# Altium schematic sheet schematic.SchDoc: Плата фильтра 1,5/2,5mHz
size 420 x 297 mm; PageSetup: Record=PageOptions|CenterHorizontal=True|CenterVertical=True|PrintScale=1.00|XCorrection=1.00|YCorrection=1.00|PrintKind=1|BorderSize=5000000|LeftOffset=0|BottomOffset=0|Orientation=2|PaperLength=1000|PaperWidth=1000|Scale=100|PaperSource=15|PrintQuality=1200|MediaType=1|DitherType=10|PaperKind=A3|PrintScaleMode=1; Weight: -; ScaleFactor: -; Date: 06.05.2025; CheckedBy: Бойков; Author: Соловьев; CompanyName: РРБО-01-24; Address1: Address1; Address2: Address2; Address3: Address3; Address4: Address4; DocumentNumber: МРАГ.43 1122.800 Э3; SheetNumber: 1; SheetTotal: 1; DocumentType: Схема электрическая принципиальная; FirstReferrence: МРАГ.43 1122.800 Э3
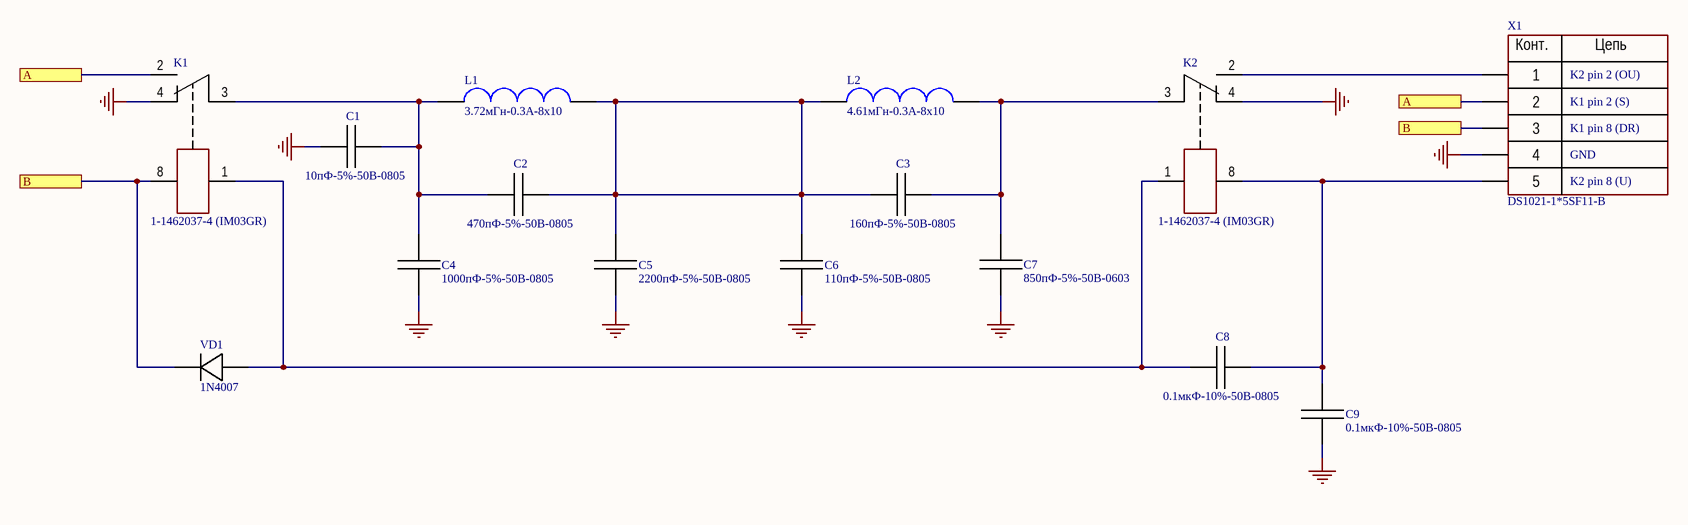
[diagram p0: schematic.SchDoc]

## Parts
C1  10пФ-5%-50В-0805  [capacitor_0805]
C2  470пФ-5%-50В-0805  [capacitor_0805]
C3  160пФ-5%-50В-0805  [capacitor_0805]
C4  1000пФ-5%-50В-0805  [capacitor_0805]
C5  2200пФ-5%-50В-0805  [capacitor_0805]
C6  110пФ-5%-50В-0805  [capacitor_0805]
C7  850пФ-5%-50В-0603  [capacitor_0603]
C8  0.1мкФ-10%-50В-0805  [capacitor_0805]
C9  0.1мкФ-10%-50В-0805  [capacitor_0805]
K1  1-1462037-4 (IM03GR)  [RELAY_IM03GR]
K2  1-1462037-4 (IM03GR)  [RELAY_IM03GR]
L1  3.72мГн-0.3А-8x10  [inductor_0810]
L2  4.61мГн-0.3А-8x10  [inductor_0810]
VD1  1N4007  [DIODE_DO41]
X1  DS1021-1*5SF11-B  [connector_5_pls]

## Ports
A, B

## Nets
GND: C1.0 C4.1 C5.1 C6.1 C7.0 C9.1 K1.4 K2.4 X1.4
A: K1.2 X1.2 ; port A
B: K1.8 VD1.1 X1.3 ; port B
NetC1_1: C1.1 C2.0 C4.0 K1.3(3(6)) L1.0
NetC2_1: C2.1 C3.0 C5.0 C6.0 L1.1 L2.0
NetC3_1: C3.1 C7.1 K2.3(3(6)) L2.1
NetC8_0: C8.0 K1.1 K2.1 VD1.0
NetC8_1: C8.1 C9.0 K2.8 X1.5
NetK2_2: K2.2 X1.1

## Notes on the sheet
- K1 pin 2 (S)
- K2 pin 2 (OU)
- GND
- K2 pin 8 (U)
- K1 pin 8 (DR)
- Перв. примен.
- Справ. №
- Подп. и дата
- Инв. № дубл.
- Взам. инв. №
- Разраб.
- Изм.
- Лист
- № докум.
- Подп.
- Дата
- Лит.
- Масса
- Масштаб
- Пров.
- Т.контр.
- Листов
- Инв. № подл.
- Утв.
- Н.контр.
- 2.106-A3
- Копировал
- Формат А3
- (in symbol Connector_5) Конт.; Цепь

## Library data of the parts
C1 = Capacitor: Manufacturer: Murata Electronics; PartNumber: GRM2165C1H100JZ01D; Href: https://www.chipdip.ru/product/grm2165c1h100j; Value: 10пФ-5%-50В-0805; Kind: Capacitor
C2 = Capacitor: Manufacturer: Murata Electronics; PartNumber: GRM2165C1H471JA01D; Href: https://www.chipdip.ru/product/grm2165c1h471j; Value: 470пФ-5%-50В-0805; Kind: Capacitor
C3 = Capacitor: Manufacturer: Тайвань; PartNumber: MLCC160pFNPO50V5%0805; Href: https://www.chipdip.ru/product0/690402999; Value: 160пФ-5%-50В-0805; Kind: Capacitor
C4 = Capacitor: Manufacturer: Murata Electronics; PartNumber: GRM2165C1H102JA01D; Href: https://www.chipdip.ru/product/grm2165c1h102j; Value: 1000пФ-5%-50В-0805; Kind: Capacitor
C5 = Capacitor: Manufacturer: Murata Electronics; PartNumber: GRM2165C1H222JA01D; Href: https://www.chipdip.ru/product/grm2165c1h222j; Value: 2200пФ-5%-50В-0805; Kind: Capacitor
C6 = Capacitor: Manufacturer: Тайвань; PartNumber: MLCC110pFNPO50V5%0805; Href: https://www.chipdip.ru/product0/636411021; Value: 110пФ-5%-50В-0805; Kind: Capacitor
C7 = Capacitor: Manufacturer: Knowles Novacap; PartNumber: C06BL851X-1SN-X0T; Href: https://www.chipdip.ru/product0/8007540631; Value: 850пФ-5%-50В-0603; Kind: Capacitor
C8 C9 = Capacitor: Manufacturer: Murata Electronics; PartNumber: GRM21BR71H104KA01L; Href: https://www.chipdip.ru/product/grm21br71h104k; Value: 0.1мкФ-10%-50В-0805; Kind: Capacitor
K1 K2 = Realy_IM03GR: Kind: Relay; Href: https://www.chipdip.ru/product/1-1462037-4-im03gr; PartNumber: 1-1462037-4 (IM03GR); Manufacturer: 1-1462037-4 (IM03GR)
L1 L2 = Inductor: PartNumber: 0810; Manufacturer: FGHGF; Kind: Inductor; Href: https://aliexpress.ru/item/1005005459804767.html?sku_id=12000033167843835&spm=a2g2w.productlist.search_results.6.1bc373f3ryn7OB
  L1: Value: 3.72мГн-0.3А-8x10
  L2: Value: 4.61мГн-0.3А-8x10
VD1 = Diode: Manufacturer: Diotec Semiconductor; PartNumber: 1N4007; Kind: Diode; Href: https://www.chipdip.ru/product/1n4007
X1 = Connector_5: Manufacturer: Connfly electronic (Zhenqin); Kind: Connector; Href: https://www.chipdip.ru/product/pls-5; PartNumber: DS1021-1*5SF11-B